# EasyEDA schematic schematic.json
TITLE: Sheet_1; REV: 1.0; Date: 2024-07-08; Sheet: 1/1; Drawn By: hude06; Company: Your Company
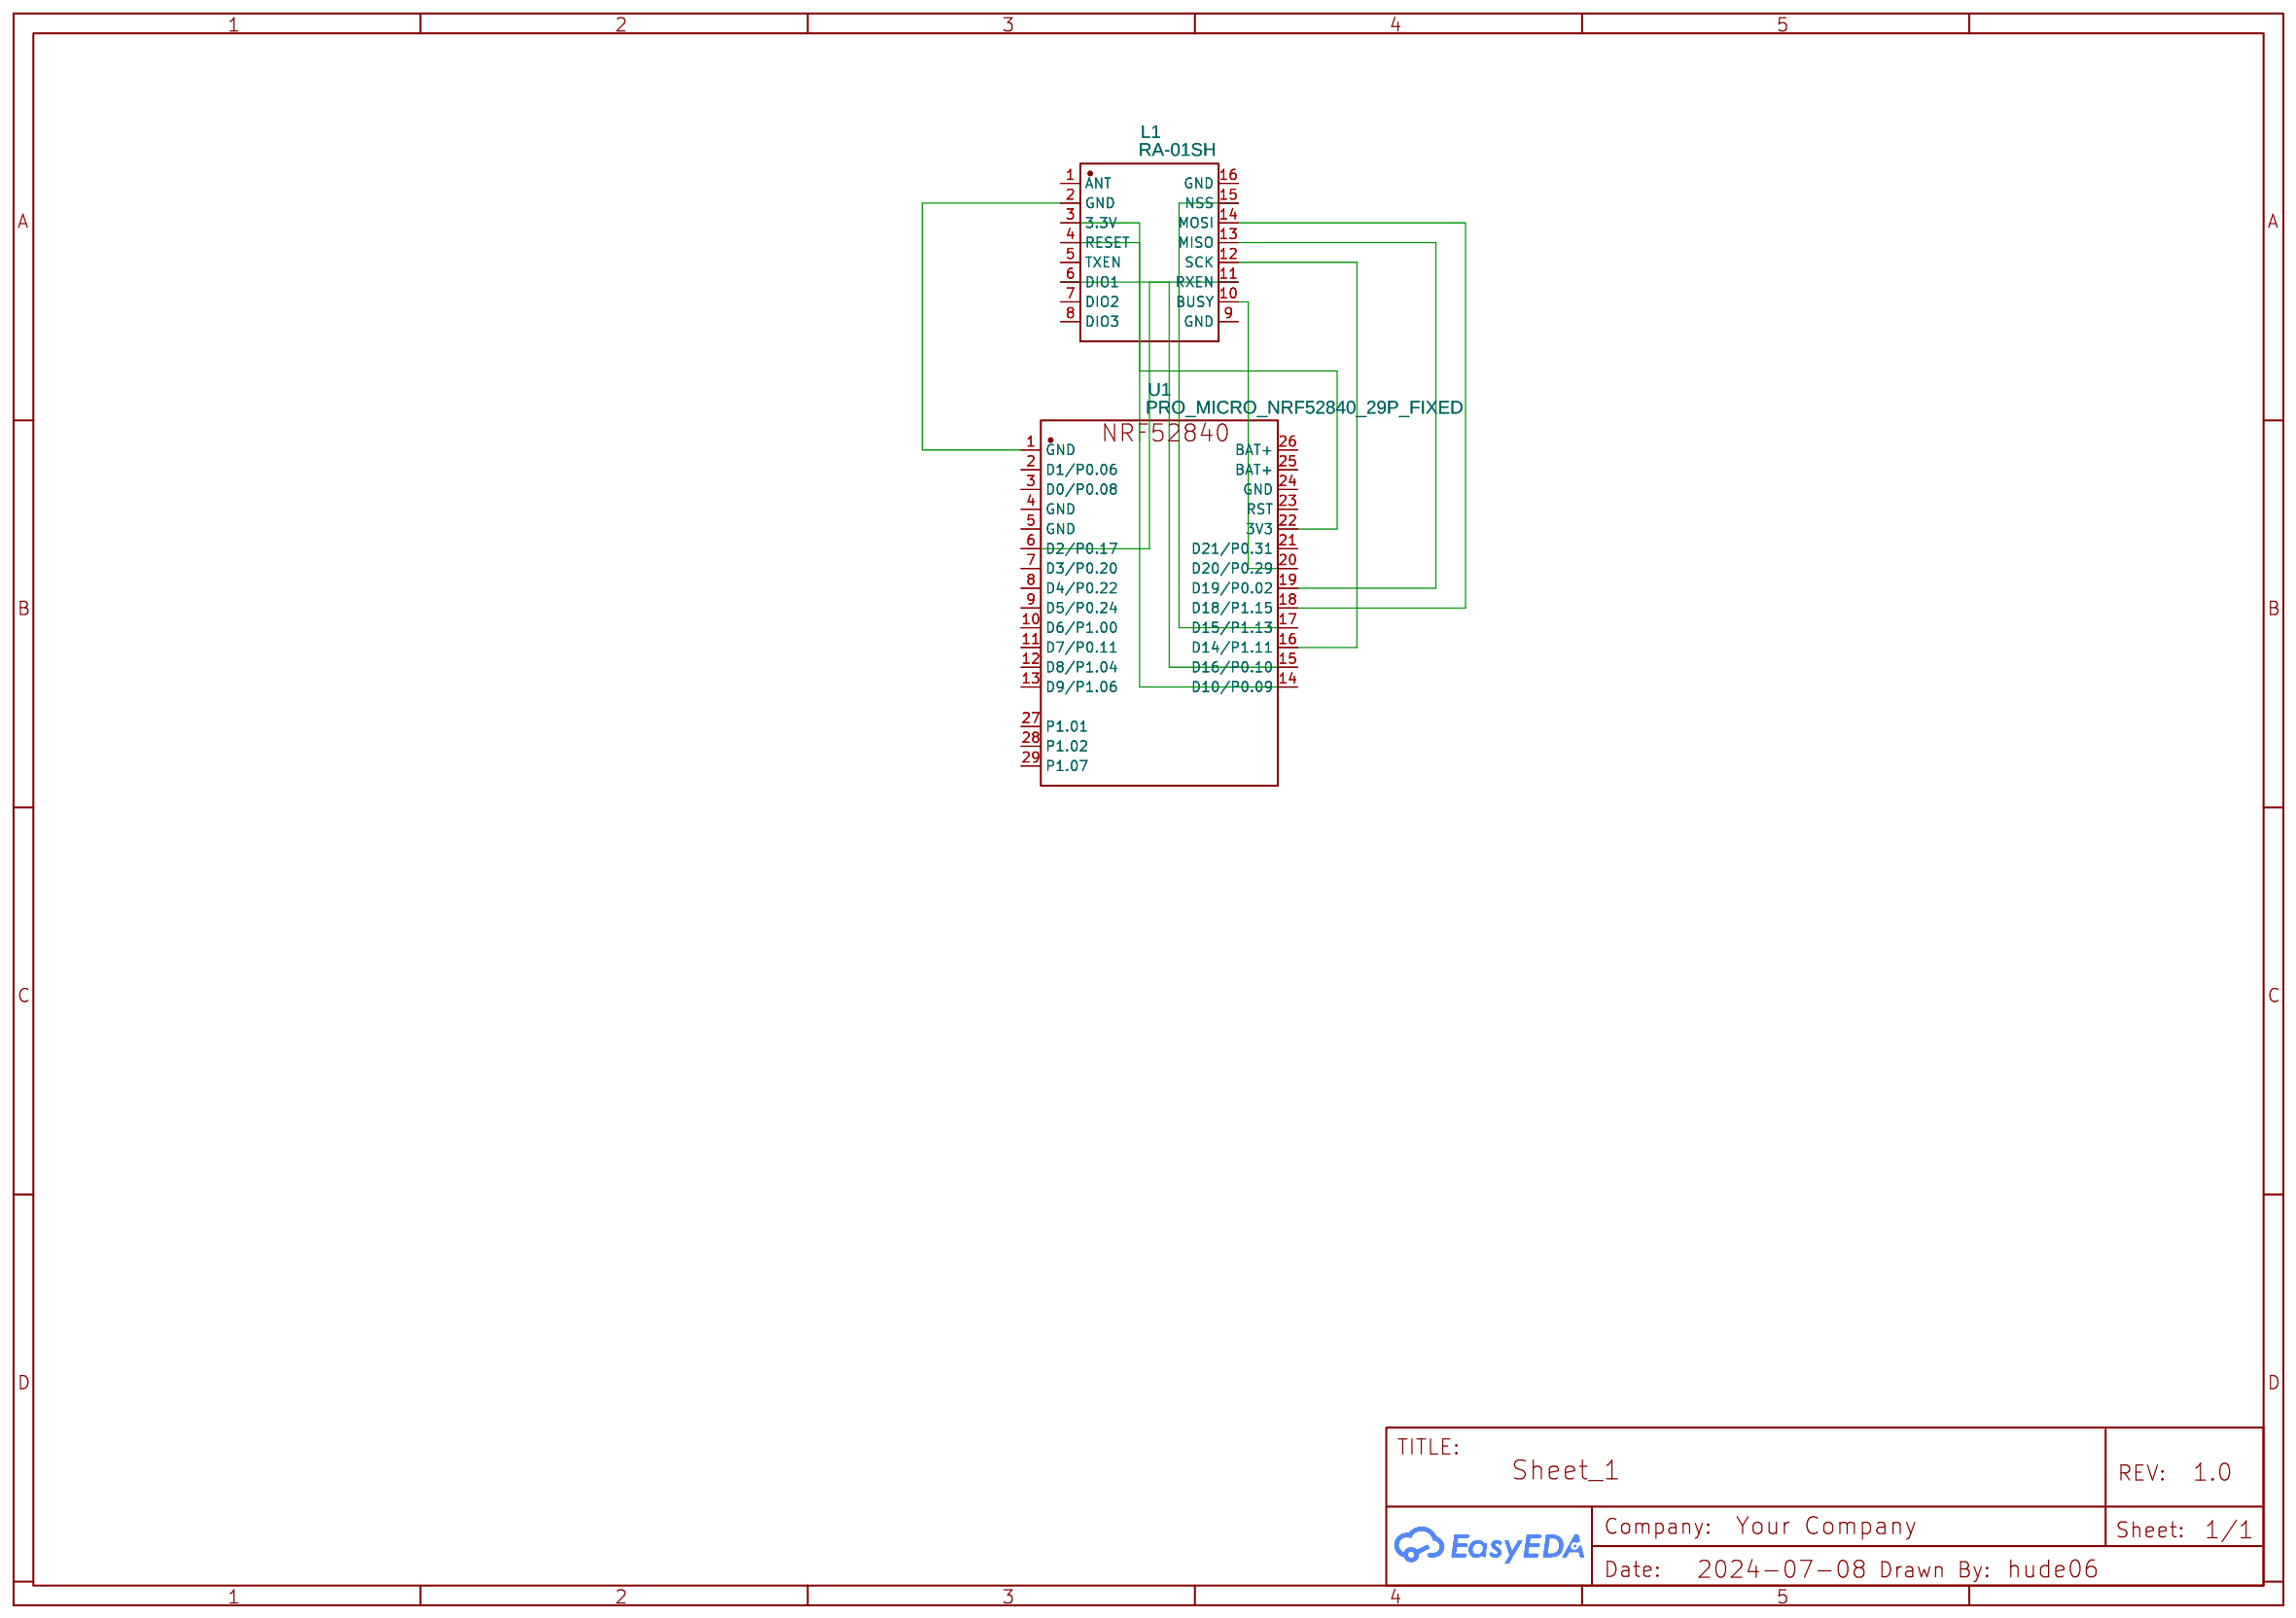
[diagram p0: schematic sheet]

## Parts
L1  RA-01SH  [WIRELM-SMD_RA-01SH]
U1  PRO_MICRO_NRF52840_29P_FIXED  [PRO_MICRO_NRF52840_29P]

## Library data of the parts
L1 = RA-01SH: Contributor: gokcelbahadir; Supplier: LCSC; Supplier Part: C2764087; Manufacturer: Ai-Thinker(安信可); Manufacturer Part: Ra-01SH; JLCPCB Part Class: Extended Part
U1 = PRO_MICRO_NRF52840_29P_FIXED: link: https://www.nologo.tech/product/otherboard/NRF52840.html#%E5%BC%95%E8%84%9A%E5%9B%BE; Contributor: kylau626

## Nets
Net-(L1-2): L1.2(GND) U1.1(GND)
Net-(L1-3): L1.3(3.3V) U1.22(3V3)
Net-(L1-4): L1.4(RESET) U1.14(D10/P0.09)
Net-(L1-6): L1.6(DIO1) U1.15(D16/P0.10)
Net-(L1-10): L1.10(BUSY) U1.20(D20/P0.29)
Net-(L1-11): L1.11(RXEN) U1.6(D2/P0.17)
Net-(L1-12): L1.12(SCK) U1.16(D14/P1.11)
Net-(L1-13): L1.13(MISO) U1.19(D19/P0.02)
Net-(L1-14): L1.14(MOSI) U1.18(D18/P1.15)
Net-(L1-15): L1.15(NSS) U1.17(D15/P1.13)

Not connected (* = marked no-connect by the designer): L1 1(ANT) 5(TXEN) 7(DIO2) 8(DIO3) 9(GND) 16(GND); U1 2(D1/P0.06) 3(D0/P0.08) 4(GND) 5(GND) 7(D3/P0.20) 8(D4/P0.22) 9(D5/P0.24) 10(D6/P1.00) 11(D7/P0.11) 12(D8/P1.04) 13(D9/P1.06) 21(D21/P0.31) 23(RST) 24(GND) 25(BAT+) 26(BAT+) 27(P1.01) 28(P1.02) 29(P1.07)
